# Altium schematic sheet 18-Led7.SchDoc
size A4; DocumentNumber: 19; SheetNumber: 18; SheetTotal: 26
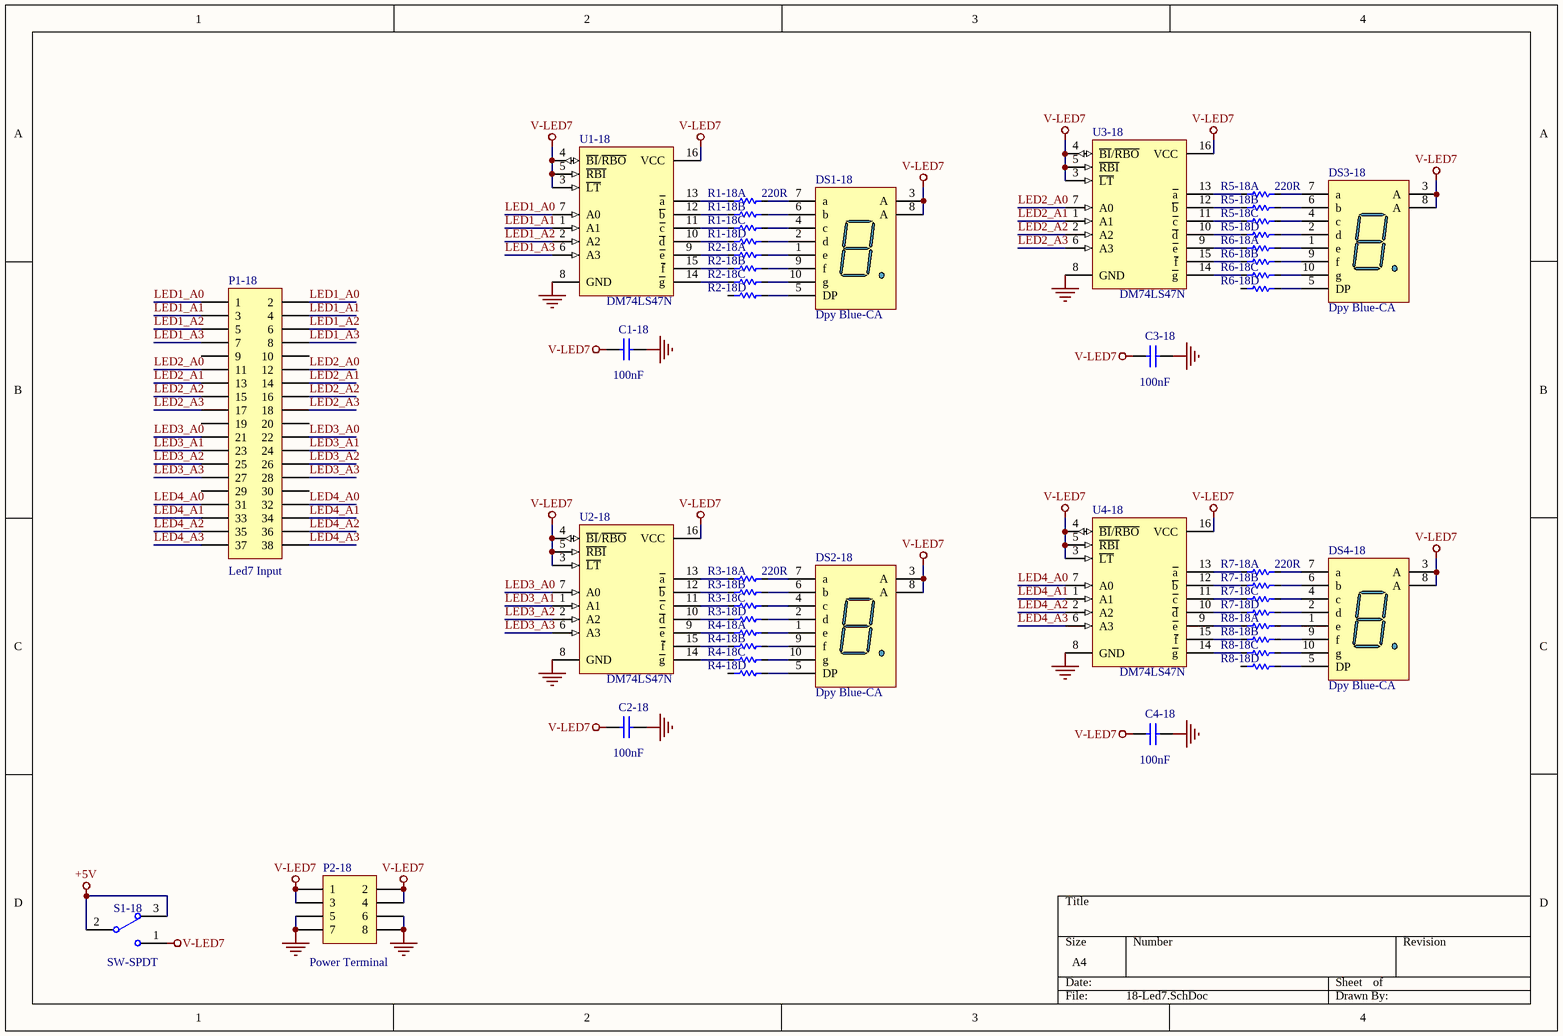
[diagram p0: 18-Led7.SchDoc]

## Parts
C1-18  value 100nF  [c-0805]  (hidden comment: 104)
C2-18  value 100nF  [c-0805]  (hidden comment: 104)
C3-18  value 100nF  [c-0805]  (hidden comment: 104)
C4-18  value 100nF  [c-0805]  (hidden comment: 104)
DS1-18  Dpy Blue-CA  [LED7-0.56inch]
DS2-18  Dpy Blue-CA  [LED7-0.56inch]
DS3-18  Dpy Blue-CA  [LED7-0.56inch]
DS4-18  Dpy Blue-CA  [LED7-0.56inch]
P1-18  value Led7 Input  [JP2.54-F-2x19A]  (hidden comment: Header 19X2)
P2-18  Publisher: Power Terminal  [JP2.54-F-2x04A]  (hidden comment: Header 4X2)
R1-18  220R  [R-Array-0603-4]  (parts A,B,C,D of 4)
R2-18  220R  [R-Array-0603-4]  (value not drawn)  (parts A,B,C,D of 4)
R3-18  220R  [R-Array-0603-4]  (parts A,B,C,D of 4)
R4-18  220R  [R-Array-0603-4]  (value not drawn)  (parts A,B,C,D of 4)
R5-18  220R  [R-Array-0603-4]  (parts A,B,C,D of 4)
R6-18  220R  [R-Array-0603-4]  (value not drawn)  (parts A,B,C,D of 4)
R7-18  220R  [R-Array-0603-4]  (parts A,B,C,D of 4)
R8-18  220R  [R-Array-0603-4]  (value not drawn)  (parts A,B,C,D of 4)
S1-18  SW-SPDT  [SW-SLIDE-2P-2W]
U1-18  DM74LS47N  [SK-DIP16-300]
U2-18  DM74LS47N  [SK-DIP16-300]
U3-18  DM74LS47N  [SK-DIP16-300]
U4-18  DM74LS47N  [SK-DIP16-300]

## Nets
+5V: S1-18.2 S1-18.3
GND: C1-18.2 C2-18.2 C3-18.2 C4-18.2 P2-18.5 P2-18.6 P2-18.7 P2-18.8 U1-18.8(GND) U2-18.8(GND) U3-18.8(GND) U4-18.8(GND)
V-LED7: C1-18.1 C2-18.1 C3-18.1 C4-18.1 DS1-18.3(A) DS1-18.8(A) DS2-18.3(A) DS2-18.8(A) DS3-18.3(A) DS3-18.8(A) DS4-18.3(A) DS4-18.8(A) P2-18.1 P2-18.2 P2-18.3 P2-18.4 S1-18.1 U1-18.3(~{LT}) U1-18.4(~{BI}/~{RBO}) U1-18.5(~{RBI}) U1-18.16(VCC) U2-18.3(~{LT}) U2-18.4(~{BI}/~{RBO}) U2-18.5(~{RBI}) U2-18.16(VCC) U3-18.3(~{LT}) U3-18.4(~{BI}/~{RBO}) U3-18.5(~{RBI}) U3-18.16(VCC) U4-18.3(~{LT}) U4-18.4(~{BI}/~{RBO}) U4-18.5(~{RBI}) U4-18.16(VCC)
LED1_A0: P1-18.1 P1-18.2 U1-18.7(A0)
LED1_A1: P1-18.3 P1-18.4 U1-18.1(A1)
LED1_A2: P1-18.5 P1-18.6 U1-18.2(A2)
LED1_A3: P1-18.7 P1-18.8 U1-18.6(A3)
LED2_A0: P1-18.11 P1-18.12 U3-18.7(A0)
LED2_A1: P1-18.13 P1-18.14 U3-18.1(A1)
LED2_A2: P1-18.15 P1-18.16 U3-18.2(A2)
LED2_A3: P1-18.17 P1-18.18 U3-18.6(A3)
LED3_A0: P1-18.21 P1-18.22 U2-18.7(A0)
LED3_A1: P1-18.23 P1-18.24 U2-18.1(A1)
LED3_A2: P1-18.25 P1-18.26 U2-18.2(A2)
LED3_A3: P1-18.27 P1-18.28 U2-18.6(A3)
LED4_A0: P1-18.31 P1-18.32 U4-18.7(A0)
LED4_A1: P1-18.33 P1-18.34 U4-18.1(A1)
LED4_A2: P1-18.35 P1-18.36 U4-18.2(A2)
LED4_A3: P1-18.37 P1-18.38 U4-18.6(A3)
NetDS1-18_1: DS1-18.1(e) R2-18.2
NetDS1-18_2: DS1-18.2(d) R1-18.8
NetDS1-18_4: DS1-18.4(c) R1-18.6
NetDS1-18_5: DS1-18.5(DP) R2-18.8
NetDS1-18_6: DS1-18.6(b) R1-18.4
NetDS1-18_7: DS1-18.7(a) R1-18.2
NetDS1-18_9: DS1-18.9(f) R2-18.4
NetDS1-18_10: DS1-18.10(g) R2-18.6
NetDS2-18_1: DS2-18.1(e) R4-18.2
NetDS2-18_2: DS2-18.2(d) R3-18.8
NetDS2-18_4: DS2-18.4(c) R3-18.6
NetDS2-18_5: DS2-18.5(DP) R4-18.8
NetDS2-18_6: DS2-18.6(b) R3-18.4
NetDS2-18_7: DS2-18.7(a) R3-18.2
NetDS2-18_9: DS2-18.9(f) R4-18.4
NetDS2-18_10: DS2-18.10(g) R4-18.6
NetDS3-18_1: DS3-18.1(e) R6-18.2
NetDS3-18_2: DS3-18.2(d) R5-18.8
NetDS3-18_4: DS3-18.4(c) R5-18.6
NetDS3-18_5: DS3-18.5(DP) R6-18.8
NetDS3-18_6: DS3-18.6(b) R5-18.4
NetDS3-18_7: DS3-18.7(a) R5-18.2
NetDS3-18_9: DS3-18.9(f) R6-18.4
NetDS3-18_10: DS3-18.10(g) R6-18.6
NetDS4-18_1: DS4-18.1(e) R8-18.2
NetDS4-18_2: DS4-18.2(d) R7-18.8
NetDS4-18_4: DS4-18.4(c) R7-18.6
NetDS4-18_5: DS4-18.5(DP) R8-18.8
NetDS4-18_6: DS4-18.6(b) R7-18.4
NetDS4-18_7: DS4-18.7(a) R7-18.2
NetDS4-18_9: DS4-18.9(f) R8-18.4
NetDS4-18_10: DS4-18.10(g) R8-18.6
NetR1-18_1: R1-18.1 U1-18.13(~{a})
NetR1-18_3: R1-18.3 U1-18.12(~{b})
NetR1-18_5: R1-18.5 U1-18.11(~{c})
NetR1-18_7: R1-18.7 U1-18.10(~{d})
NetR2-18_1: R2-18.1 U1-18.9(~{e})
NetR2-18_3: R2-18.3 U1-18.15(~{f})
NetR2-18_5: R2-18.5 U1-18.14(~{g})
NetR3-18_1: R3-18.1 U2-18.13(~{a})
NetR3-18_3: R3-18.3 U2-18.12(~{b})
NetR3-18_5: R3-18.5 U2-18.11(~{c})
NetR3-18_7: R3-18.7 U2-18.10(~{d})
NetR4-18_1: R4-18.1 U2-18.9(~{e})
NetR4-18_3: R4-18.3 U2-18.15(~{f})
NetR4-18_5: R4-18.5 U2-18.14(~{g})
NetR5-18_1: R5-18.1 U3-18.13(~{a})
NetR5-18_3: R5-18.3 U3-18.12(~{b})
NetR5-18_5: R5-18.5 U3-18.11(~{c})
NetR5-18_7: R5-18.7 U3-18.10(~{d})
NetR6-18_1: R6-18.1 U3-18.9(~{e})
NetR6-18_3: R6-18.3 U3-18.15(~{f})
NetR6-18_5: R6-18.5 U3-18.14(~{g})
NetR7-18_1: R7-18.1 U4-18.13(~{a})
NetR7-18_3: R7-18.3 U4-18.12(~{b})
NetR7-18_5: R7-18.5 U4-18.11(~{c})
NetR7-18_7: R7-18.7 U4-18.10(~{d})
NetR8-18_1: R8-18.1 U4-18.9(~{e})
NetR8-18_3: R8-18.3 U4-18.15(~{f})
NetR8-18_5: R8-18.5 U4-18.14(~{g})

Not connected (* = marked no-connect by the designer): P1-18 9 10 19 20 29 30; R2-18 7(1); R4-18 7(1); R6-18 7(1); R8-18 7(1)

## Library data of the parts
C1-18 C2-18 C3-18 C4-18 = Cap: Capacitor; Published: 8-Jun-2000; LatestRevisionDate: 17-Jul-2002; LatestRevisionNote: Re-released for DXP Platform.; PackageReference: RAD-0.3; Publisher: Altium Limited; PackageDescription: Radial Cap, Thru-Hole; 2 Leads; 0.3 in Pin Spacing
DS1-18 DS2-18 DS3-18 DS4-18 = Dpy Blue-CA: 14.2 mm General Purpose Blue 7-Segment Display: CA, RH DP, Gray Surface; MinimumIntensity: 2020 ucd; Note: IF = 10 mA; Published: 8-Jun-2000; LatestRevisionDate: 17-Dec-2003; LatestRevisionNote: Schematic revised, PCB Footprint replaced.; DatasheetVersion: 24-Sep-2002; PackageVersion: 24-Sep-2002; PackageReference: H; Publisher: Altium Limited; PackageDescription: LED, 7-Segment Display, 14.2 mm, RHD; 10 Leads; Row Space 15.24 mm; Pitch 2.54 mm; Colour: Blue; ComponentLink1Description: Manufacturer Link; ComponentLink1URL: http://www.agilent.com/
P1-18 = Header 19X2: Header, 19-Pin, Dual row; LatestRevisionDate: 17-Jul-2002; LatestRevisionNote: Re-released for DXP Platform.
P2-18 = Header 4X2: Header, 4-Pin, Dual row; LatestRevisionDate: 17-Jul-2002; LatestRevisionNote: Re-released for DXP Platform.
R1-18 R2-18 R3-18 R4-18 R5-18 R6-18 R7-18 R8-18 = R-8P4R: RES ARRAY 4 RES 330 OHM 1206; Manufacturer: Panasonic Electronic Components; Manufacturer Part Number: EXB-38V331JV; Digi-Key Part Number: Y9331TR-ND; Link: http://www.digikey.com/product-detail/en/EXB-38V331JV/Y9331TR-ND/256525
S1-18 = SW-SPDT: SPDT Subminiature Toggle Switch, Right Angle Mounting, Vertical Actuation; Published: 24-Mar-1999; LatestRevisionDate: 17-Dec-2003; LatestRevisionNote: Schematic revised, PCB Footprint replaced.; DatasheetVersion: 05-Dec-2000; PackageReference: TL36WW15050; Publisher: Altium Limited; PackageDescription: Switch; 4 Leads; ComponentLink1Description: Manufacturer Link; ComponentLink1URL: http://www.apem.com
U1-18 U2-18 U3-18 U4-18 = DM74LS47N: BCD to 7-Segment Decoder/Driver with Open-Collector Output; Published: 17-Jul-2002; LatestRevisionDate: 04-Mar-2005; LatestRevisionNote: Stylized 3D Model Added.; DatasheetVersion: Mar-1998; PackageVersion: 2000; PackageReference: N16E; Publisher: Altium Limited; PackageDescription: DIP, 16-Pin, Row Spacing 7.62 mm, Pitch 2.54 mm; ComponentLink1Description: Manufacturer Link; ComponentLink1URL: http://www.fairchildsemi.com/